# EAGLE design Wykonana (EAGLE 6.1)
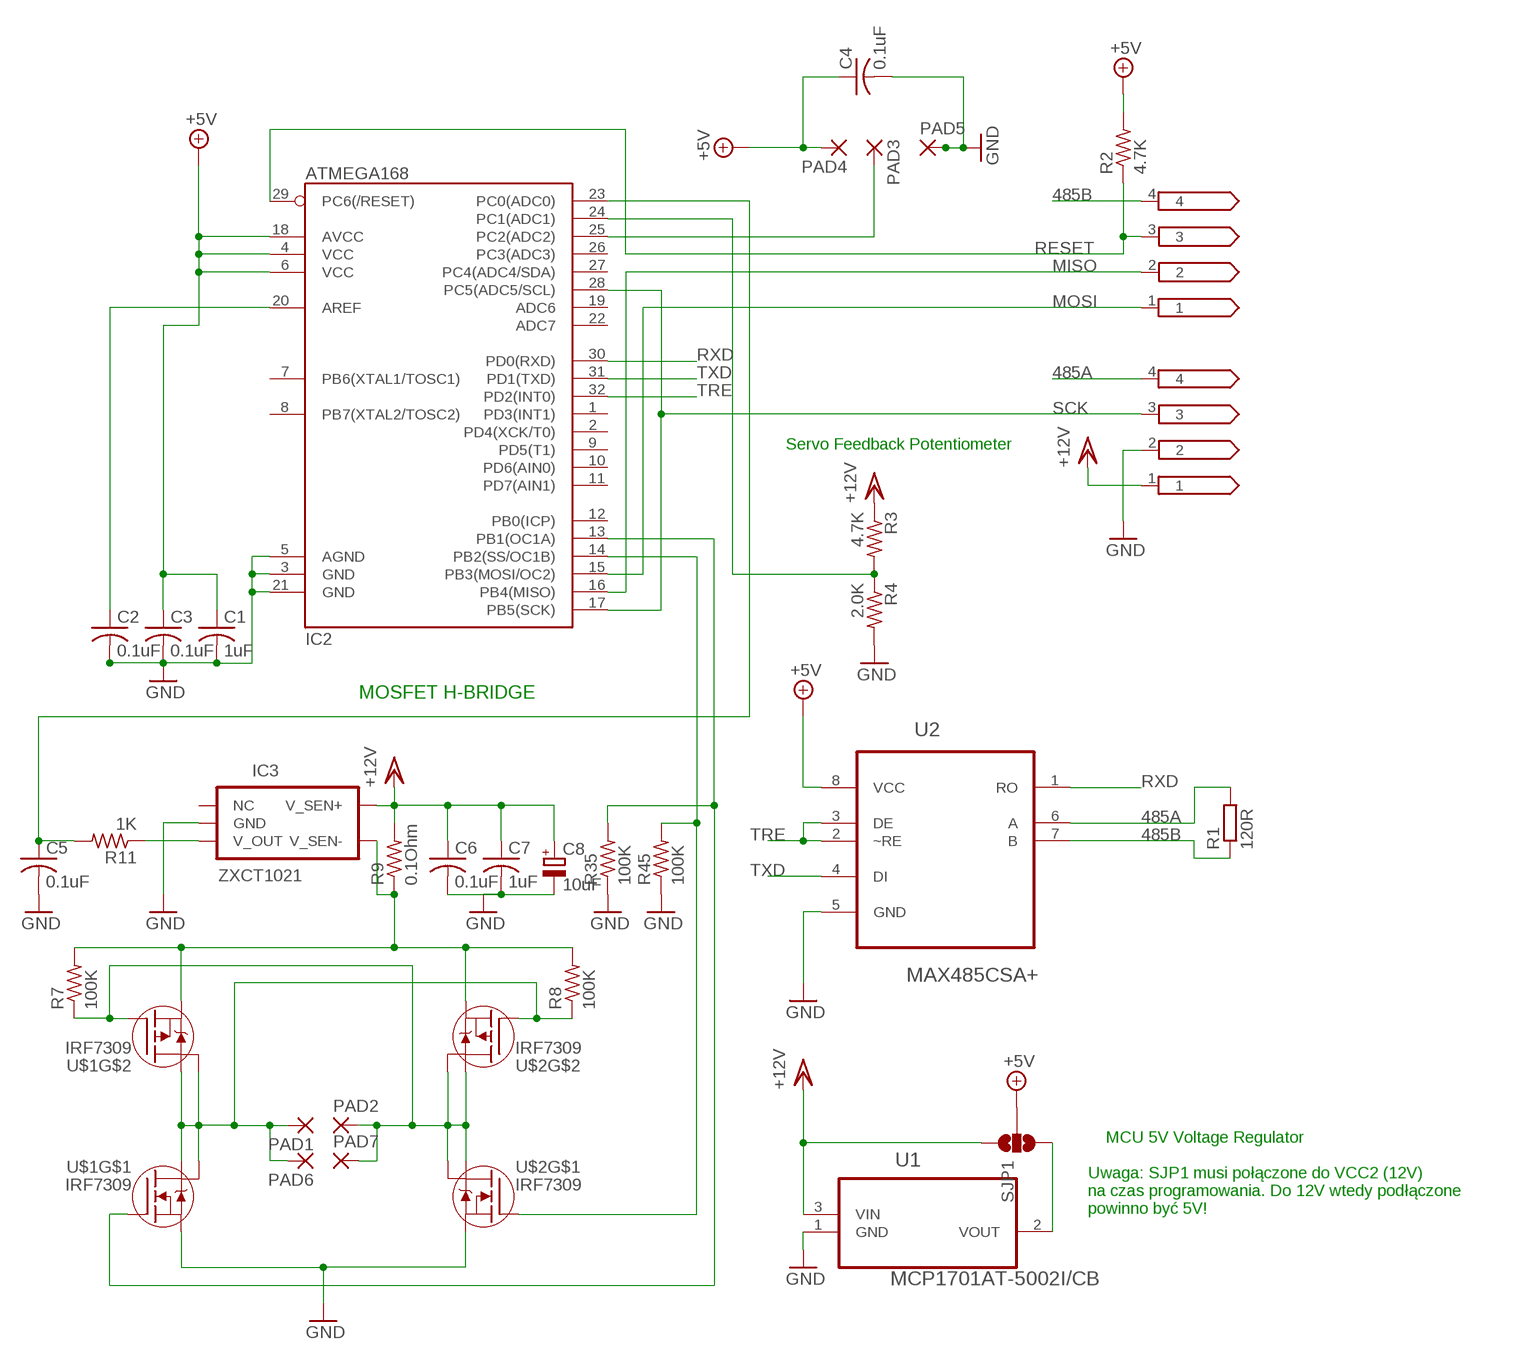
[diagram p0: schematic, sheet 1]

## Parts
C1  1uF  C-USC0603  [C0603]
C2  0.1uF  C-USC0603  [C0603]
C3  0.1uF  C-USC0603  [C0603]
C4  0.1uF  C-USC0603  [C0603]
C5  0.1uF  C-USC0603K  [C0603K]
C6  0.1uF  C-USC0603  [C0603]
C7  1uF  C-USC0603  [C0603]
C8  10uF  CPOL-EUA/3216-18R  [A/3216-18R]
IC2  ATMEGA168  [TQFP32-08]
IC3  ZXCT1021  ZXCT1021SOT23-5  [SOT23-5]
JP1  4-EDGEVERSION2  [4-PIN-EDGE-V2]
JP2  4-EDGEVERSION2  [4-PIN-EDGE-V2]
PAD1  2,15/1,0  [2,15/1,0]
PAD2  2,15/1,0  [2,15/1,0]
PAD3  1,6/0,8  [1,6/0,8]
PAD4  1,6/0,8  [1,6/0,8]
PAD5  1,6/0,8  [1,6/0,8]
PAD6  2,15/1,0  [2,15/1,0]
PAD7  2,15/1,0  [2,15/1,0]
R1  120R  R-EU_R0603  [R0603]
R2  4.7K  R-US_R0603  [R0603]
R3  4.7K  R-US_R0603  [R0603]
R4  2.0K  R-US_R0603  [R0603]
R7  100K  R-US_R0603  [R0603]
R8  100K  R-US_R0603  [R0603]
R9  0.1Ohm  R-US_R0603  [R0603]
R11  1K  R-US_R0603  [R0603]
R35  100K  R-US_R0603  [R0603]
R45  100K  R-US_R0603  [R0603]
SJP1  SOLDERJUMPER_2WAYPASTE2&3  [SJ_3_PASTE2&3]
U1  MCP1701AT-5002I/CB  [SOT95P255X145-3N]
U2  MAX485CSA+  [SOIC127P600X175-8N]
U$1  IRF7309  [SO8-2]
U$2  IRF7309  [SO8-2]

## Nets
485A: JP1.4 R1.2 U2.6(A)
485B: JP2.4 R1.1 U2.7(B)
+5V: C1.1 C3.1 C4.1 IC2.4(VCC) IC2.6(VCC) IC2.18(AVCC) PAD4.1(P) R2.2 SJP1.2 U2.8(VCC)
CURRENT: C5.1 IC2.23(PC0(ADC0)) R11.2
GND: C1.2 C2.2 C3.2 C4.2 C5.2 C6.2 C7.2 C8.- IC2.3(GND) IC2.5(AGND) IC2.21(GND) IC3.2(GND) JP1.2 PAD5.1(P) R4.2 R35.1 R45.1 U1.1(GND) U2.5(GND) U$1.1(S) U$2.1(S)
MISO: IC2.16(PB4(MISO)) JP2.2
MOSI: IC2.15(PB3(MOSI/OC2)) JP2.1
N$1: SJP1.3 U1.2(VOUT)
N$4: PAD2.1(P) PAD7.1(P) R7.1 U$1.4(G) U$2.5(D) U$2.6(D) U$2.7(D) U$2.8(D)
N$5: IC3.3(V_OUT) R11.1
N$10: IC3.5(V_SEN-) R7.2 R8.2 R9.1 U$1.3(S) U$2.3(S)
N$11: IC2.14(PB2(SS/OC1B)) R45.2 U$2.2(G)
N$14: IC2.25(PC2(ADC2)) PAD3.1(P)
N$19: IC2.13(PB1(OC1A)) R35.2 U$1.2(G)
N$21: C2.1 IC2.20(AREF)
N$22: IC2.24(PC1(ADC1)) R3.2 R4.1
N$23: PAD1.1(P) PAD6.1(P) R8.1 U$1.5(D) U$1.6(D) U$1.7(D) U$1.8(D) U$2.4(G)
RESET: IC2.29(PC6(/RESET)) JP2.3 R2.1
RXD: IC2.30(PD0(RXD)) U2.1(RO)
SCK: IC2.17(PB5(SCK)) IC2.28(PC5(ADC5/SCL)) JP1.3
TRE: IC2.32(PD2(INT0)) U2.2(~RE) U2.3(DE)
TXD: IC2.31(PD1(TXD)) U2.4(DI)
VCC/2: C6.1 C7.1 C8.+ IC3.4(V_SEN+) JP1.1 R3.1 R9.2 SJP1.1 U1.3(VIN) ; supply symbol labelled +12V
Unconnected: IC2.1(PD3(INT1)) IC2.2(PD4(XCK/T0)) IC2.7(PB6(XTAL1/TOSC1)) IC2.8(PB7(XTAL2/TOSC2)) IC2.9(PD5(T1)) IC2.10(PD6(AIN0)) IC2.11(PD7(AIN1)) IC2.12(PB0(ICP)) IC2.19(ADC6) IC2.22(ADC7) IC2.26(PC3(ADC3)) IC2.27(PC4(ADC4/SDA)) IC3.1(NC)

## Notes on the sheet
- Servo Feedback Potentiometer
- MOSFET H-BRIDGE
- MCU 5V Voltage Regulator
- Uwaga: SJP1 musi połączone do VCC2 (12V)
- na czas programowania. Do 12V wtedy podłączone
- powinno być 5V!

## Library data of the parts
C1-C7 = rcl:C-US: CAPACITOR, American symbol
C8 = rcl:CPOL-EU: POLARIZED CAPACITOR, European symbol
IC2 = MOJA:ATMEGA168
IC3 = MOJA:ZXCT1021: Low offset high-side current monitor http://www.diodes.com/zetex/_pdfs/3.0/pdf/ZXCT1021.pdf
JP1 JP2 = openservo:4-EDGE
PAD1 PAD2 PAD6 PAD7 = wirepad:2,15/1,0: THROUGH-HOLE PAD
PAD3-PAD5 = wirepad:1,6/0,8: THROUGH-HOLE PAD
R1 = resistor:R-EU_: RESISTOR, European symbol
R2-R4 R7-R9 R11 R35 R45 = rcl:R-US_: RESISTOR, American symbol
SJP1 = MOJA:SOLDERJUMPER_2WAY: Solder Jumper 2 way solder jumper
U1 = mcp1701AT-5002:MCP1701AT-5002I/CB: IC, LDO REG, 250MA, 5.0V; MPN: MCP1701AT-5002I/CB; OC_FARNELL: 1605556; OC_NEWARK: 11N7987; PACKAGE: SOT-23; SUPPLIER: MICROCHIP
U2 = MAX485CSA:MAX485CSA+: ±15kV ESD-Protected, Slew-Rate-Limited, Low-Power, RS-485/RS-422 Transceivers; MPN: MAX485CSA+; OC_FARNELL: 9725954; OC_NEWARK: 68K4795; PACKAGE: SOIC-8; SUPPLIER: Maxim
U$1 U$2 = irf-2:IRF7309

## Board
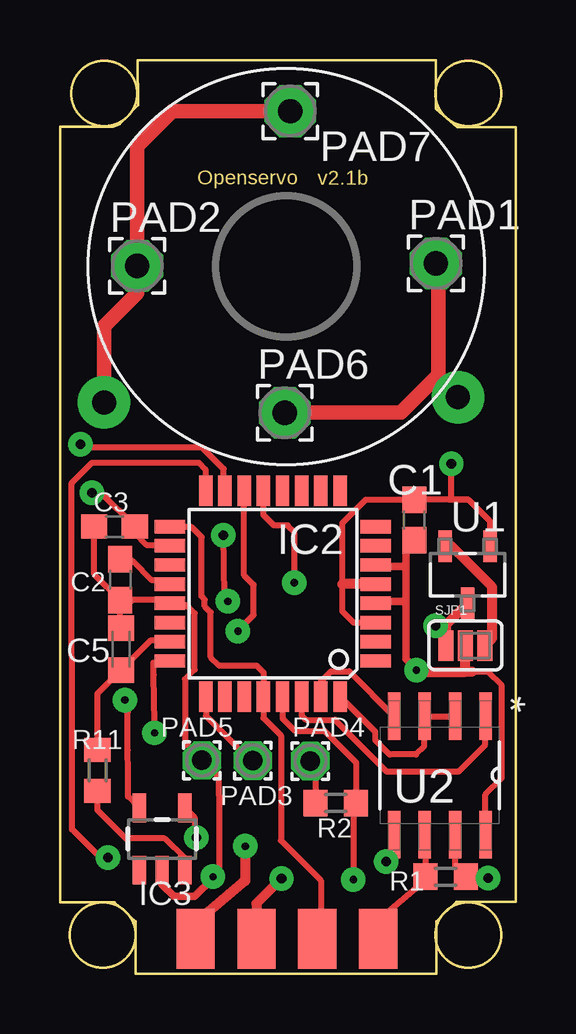
[diagram p1: board, top side]
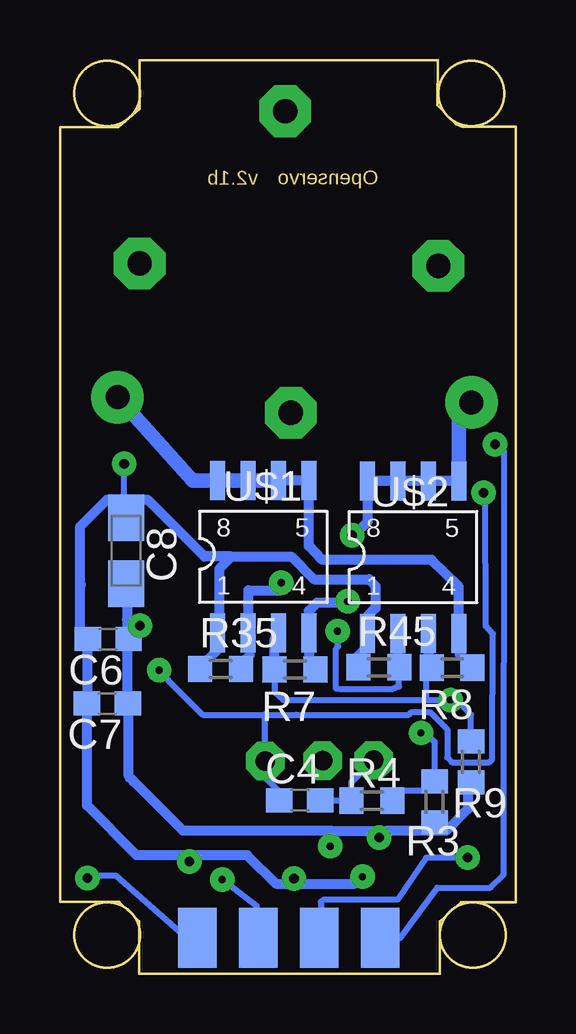
[diagram p2: board, bottom side, seen from below]

Size 19 x 38.09 mm. Coordinates in mm from the lower left corner, seen from the top.
Outline: 3.15,0 15.7,0 15.7,2.18 16.53,3 19,2.99 19,35.28 16.57,35.3 15.67,36.06 15.67,38.08 3.56,38.09 3.24,38.09 3.26,36.2 2.49,35.41 2.21,35.31 1.66,35.3 0,35.32 0,2.97 2.28,2.97 3.15,2.18 3.15,0
Outline: circle at 1.78,1.62 radius 1.36
Outline: circle at 17.04,1.62 radius 1.36
Outline: circle at 17.04,36.69 radius 1.36
Outline: circle at 1.85,36.69 radius 1.36
Copper layers (1*16): Top 0.035mm / dielectric 1.5mm / Bottom 0.035mm
Design rules: minimum track width 5mil, minimum drill 10mil, track to track 8mil, track to pad 8mil, pad to pad 8mil, via to via 4mil, smd to smd 2mil, copper to edge 4mil, drill to drill 4mil, minimum pad ring 10mil, minimum via ring 8mil, stop-mask expansion 2mil, vias tented up to drill 0mil, thermal gap 10mil

### Footprints (pad centres in the part's own frame; a part is rotated, then mirrored left to right if it is on the bottom)
C0603 = smd 1.1 x 1: 1 -0.85,0; 2 0.85,0
C0603K = smd 1.05 x 1.08: 1 -0.875,0; 2 0.875,0
A/3216-18R = smd 1.95 x 1.5: + 1.375,0; - -1.375,0
TQFP32-08 = smd 1.27 x 0.559: 1 -4.293,2.8; 2 -4.293,2; 3 -4.293,1.2; 4 -4.293,0.4; 5 -4.293,-0.4; 6 -4.293,-1.2; 7 -4.293,-2; 8 -4.293,-2.8; 17 4.293,-2.8; 18 4.293,-2; 19 4.293,-1.2; 20 4.293,-0.4; 21 4.293,0.4; 22 4.293,1.2; 23 4.293,2; 24 4.293,2.8 | smd 0.559 x 1.27: 9 -2.8,-4.293; 10 -2,-4.293; 11 -1.2,-4.293; 12 -0.4,-4.293; 13 0.4,-4.293; 14 1.2,-4.293; 15 2,-4.293; 16 2.8,-4.293; 25 2.8,4.293; 26 2,4.293; 27 1.2,4.293; 28 0.4,4.293; 29 -0.4,4.293; 30 -1.2,4.293; 31 -2,4.293; 32 -2.8,4.293
SOT23-5 = smd 0.55 x 1.2: 1 -0.95,-1.3; 2 0,-1.3; 3 0.95,-1.3; 4 0.95,1.3; 5 -0.95,1.3
4-PIN-EDGE-V2 = smd 2.5 x 1.6: 1 0.508,4.318; 2 0.508,1.778; 3 0.508,-0.762; 4 0.508,-3.302
2,15/1,0 = drill 1.016 pad 2.159 octagon: 1 0,0
1,6/0,8 = drill 0.813 pad 1.6 octagon: 1 0,0
R0603 = smd 1 x 1.1: 1 -0.85,0; 2 0.85,0
SJ_3_PASTE2&3 = smd 0.635 x 1.27: 1 -0.813,0; 2 0,0; 3 0.813,0
SOT95P255X145-3N = smd 0.559 x 1.321: 1 -0.94,-1.194; 2 0.94,-1.194; 3 0,1.194
SOIC127P600X175-8N = smd 1.981 x 0.533: 1 -2.464,1.905; 2 -2.464,0.635; 3 -2.464,-0.635; 4 -2.464,-1.905; 5 2.464,-1.905; 6 2.464,-0.635; 7 2.464,0.635; 8 2.464,1.905
SO8-2 = smd 0.61 x 1.626: 1 -2.54,-2.54; 2 -1.27,-2.54; 3 0,-2.54; 4 1.27,-2.54; 5 1.27,3.81; 6 0,3.81; 7 -1.27,3.81; 8 -2.54,3.81

### Placement (x,y rotation side)
C1  14.77,18.91 90 top
C2  2.51,16.42 270 top
C3  2.28,18.63 180 top
C4  9,7.23 0 bottom
C5  2.55,13.53 90 top
C6  16.98,13.95 180 bottom
C7  17.02,11.27 180 bottom
C8  16.24,17.63 270 bottom
IC2  8.88,15.84 180 top
IC3  4.26,5.62 0 top
JP1  9.97,0.94 90 top
JP2  9.96,2 270 bottom
PAD1  15.68,29.61 0 top
PAD2  3.22,29.51 0 top
PAD3  8.04,8.88 0 top
PAD4  10.44,8.87 0 top
PAD5  5.92,8.89 0 top
PAD6  9.38,23.38 0 top
PAD7  9.61,35.96 0 top
R1  16.08,4.04 180 top
R2  11.5,7.12 180 top
R3  3.38,7.17 90 bottom
R4  5.99,7.22 180 bottom
R7  9.2,12.69 180 bottom
R8  2.65,12.76 180 bottom
R9  1.86,8.83 270 bottom
R11  1.57,8.48 90 top
R35  12.3,12.71 0 bottom
R45  5.7,12.77 0 bottom
SJP1  16.91,13.68 0 top
U1  17,16.63 180 top
U2  15.84,8.27 270 top
U$1  9.89,16.74 0 bottom
U$2  3.64,16.73 0 bottom

### Tracks (layer width: path | path; a pad name or v marks a point on that pad's centre or on a via)
485A
  Top 0.254: JP1.4 13.25,1.48 13.25,2.23 15.4,4.04 R1.2 15.23,5.78 U2.6
485B  (via drill 0.4 pad 1.02)
  Top 0.254: v17.85,3.99 18.14,4.04 R1.1 | 17.5,4.07 R1.1 | U2.7 16.48,4.5 R1.1
  Bottom 0.254: JP2.4 13.26,1.6 13.85,1.6 16.65,4.08 18.13,4.08 v17.85,3.99
+5V  (via drill 0.3 pad 1.02, 0.4 pad 1.02)
  Top 0.254: IC2.18 4.51,17.73 4.36,17.96 4.27,17.87 3.6,17.87 3.13,18.34 C3.1 1.72,20.04 v1.33,20.04 | 13.18,15.5 13.11,15.5 | 13.18,15.5 IC2.4 | 13.26,17.07 13.34,16.98 | 13.18,15.5 13.19,15.51 | R2.2 10.67,7.99 10.67,8.64 PAD4.1 | U2.8 17.75,7.47 18.42,8.14 18.42,12.03 17.86,12.59 17.19,12.59
  Top 0.305: v14.86,12.65 14.86,12.69 14.43,13.12 14.43,15.45 | 14.43,15.45 14.43,16.98 | 14.43,16.98 14.43,17.61 C1.1 | 13.34,16.98 14.43,16.98 | 13.19,15.51 14.37,15.51 14.43,15.45
  Top 0.406: 13.26,17.07 IC2.6 | 16.91,12.59 SJP1.2 | v14.86,12.65 15.23,12.59 16.91,12.59 | 17.19,12.59 16.91,12.59 | C1.1 14.71,17.89
  Bottom 0.254: v1.33,20.04 1.26,19.7 1.25,14.49 0.95,14.16 0.97,9.11 0.97,8.93 1.08,8.82 2.66,8.82 2.85,9.01 2.85,10.19 3.57,10.91 4.33,10.91 4.45,10.8 9.15,10.8 | v14.86,12.65 14.48,12.23 13.05,10.8 9.15,10.8 | C4.1 9.67,7.41 10.43,8.17 PAD4.1 10.44,9.26 10.44,10.81 9.15,10.8
CURRENT
  Top 0.254: 4.72,13.82 4.54,13.79 IC2.23 4.49,13.84 4.42,13.91 4.4,13.88 3.78,13.88 C5.1 | 2.8,13.01 C5.1 | R11.2 1.57,11.68 C5.1
GND  (via drill 0.3 pad 1.02, 0.4 pad 1.02)
  Top 0.254: IC2.21 4.56,15.39 4.54,15.41 4.51,15.36 | IC2.21 4.76,15.38 4.84,15.48 4.83,15.36 5.28,15.36 5.62,15.03 5.62,12.68 5.21,12.27 5.22,9.63 5.5,9.32 PAD5.1 6.63,8.17 6.63,7.44 6.63,4.3 v6.38,4.04 | IC2.3 12.24,14.64 11.77,15.12 11.77,16.25 11.77,18.77 12.76,19.76 C1.2 17.04,19.76 | IC2.21 4.3,15.44 4.33,15.46 4.22,15.57 C2.2 | 8.08,1.56 JP1.2 | C2.2 3.03,15.57 | C2.2 1.43,16.65 C3.2 | C5.2 2.51,14.45 C2.2 | 17.04,19.76 17.94,18.86 U1.1 | 17.04,19.76 17.02,19.75 16.21,19.75 16.32,19.87 v16.32,21.25
  Top 0.305: 8.08,1.56 8.23,1.72 | v6.38,4.04 6.38,3.98 5.62,3.22 4.75,3.22 4.26,3.71 IC3.2
  Top 0.406: IC2.5 11.77,16.24 11.77,16.25 | U2.5 13.94,5.01 v13.61,4.68 | v9.24,3.97 8.2,2.92 JP1.2
  Bottom 0.254: R45.1 6.6,12.75 | U$1.1 12.36,13.59 12.46,13.69 | 13.15,12.78 R35.1 | U$1.1 12.43,13.5 | 6.18,14.9 U$2.1 6.18,14.25 6.19,14.26 6.19,13.63 | U$1.1 12.43,14.29 12.45,14.32 12.36,14.4 | C4.2 6.85,7.23 R4.2 6.84,7.24 6.85,7.98 PAD5.1 | v13.61,4.68 13.61,4.8 13.75,4.94 | 16.19,19.76 16.32,19.89 v16.32,21.25
  Bottom 0.406: 12.43,13.5 13.15,12.78 | 6.18,14.9 5.83,15.24 5.83,16.16 6.11,16.44 8.4,16.44 9.35,17.39 11.84,17.39 | 11.84,17.39 12.36,16.87 12.36,14.4 | R45.1 6.56,13.26 6.19,13.63 | R35.1 13.24,12.61 | 9.45,3.75 6.71,3.75 v6.38,4.04 | 9.45,3.75 10,3.75 11.19,4.94 13.75,4.94 15.8,4.94 17.87,7.01 C7.2 17.84,11.31 C6.2 18.15,13.95 18.15,16.22 | 9.45,3.75 v9.24,3.97 | 18.15,16.22 18.13,16.22 | 11.84,17.39 12.97,17.39 15.35,19.76 16.19,19.76 16.21,19.75 | 18.15,16.22 18.15,18.65 17.05,19.75 16.21,19.75 | C8.- 16.21,19.01 16.21,19.75
MISO  (via drill 0.4 pad 1.02)
  Top 0.254: IC2.16 6.07,20.6 6.07,21.03 5.8,21.3 1.34,21.3 0.49,20.45 0.5,6.01 1.67,4.84 v2,4.84
  Bottom 0.254: JP2.2 8.12,1.68 8.12,2.99 8.01,3.09 4.92,3.09 3.73,4.84 v2,4.84
MOSI  (via drill 0.4 pad 1.02)
  Top 0.254: IC2.15 6.88,20.25 6.83,20.31 6.83,21.05 5.94,21.94 0.73,21.94 v0.86,22.08
  Bottom 0.254: 5.67,2.16 JP2.1 4.8,1.49 3.27,3.58 1.05,3.58 0.5,4.13 0.47,21.77 0.68,21.97 v0.86,22.08
N$1
  Top 0.406: SJP1.3 18.03,13.99 18.03,16.12 16.32,17.82 U1.2
N$4  (via drill 0.3 pad 1.02, 0.4 pad 1.02, 1 pad 2.18)
  Top 0.254: v7,15.52 7,15.56 6.84,15.73 v6.81,18.28
  Top 0.61: PAD7.1 9.61,35.88 9.59,35.87 9.5,35.96 4.68,35.96 3.22,34.5 PAD2.1 3.22,28.38 1.83,26.99 v1.83,23.82
  Bottom 0.254: U$2.5 2.37,20.59 2.32,20.64 | 8.62,13.02 R7.1
  Bottom 0.406: U$2.5 U$2.6 U$2.7 U$2.8 6.18,18.84 6.91,18.1 v6.81,18.28 | 8.62,13.02 U$1.4 8.62,15.13 8.29,15.46 7.1,15.46 7.09,15.45 v7,15.52
  Bottom 0.61: 2.42,20.54 U$2.5 2.37,23.28 v1.83,23.82
N$5
  Top 0.254: R11.1 1.57,6.82 2.75,5.64 4.37,5.64 5.21,4.8 IC3.3 5.21,4.69
N$10  (via drill 0.3 pad 1.02)
  Top 0.254: IC3.5 2.84,7.39 2.84,8.41 2.82,9.32 2.82,10.9 2.71,11.01 v2.71,11.41
  Bottom 0.254: 3.61,13.12 3.42,12.93 R8.2 3.42,12.56 3.74,12.25 3.74,11.42 3.75,11.41 | U$1.3 9.88,14.1 10.05,13.94 | 10.03,12.49 10.03,11.72 9.66,11.39 3.76,11.39 3.75,11.41 | R9.1 1.86,10.8 2.47,11.41 v2.71,11.41 3.75,11.41
  Bottom 0.406: 3.61,13.12 U$2.3 | 10.05,13.94 R7.2 10.05,12.51 10.03,12.49
N$11  (via drill 0.3 pad 1.02)
  Top 0.254: IC2.14 7.68,16.61 8.08,16.21 8.08,14.96 7.42,14.3 v7.42,14.28
  Bottom 0.254: v7.42,14.28 7.4,14.06 7.4,13.64 7.49,13.55 7.49,11.88 7.31,11.85 5.15,11.85 4.86,11.97 4.86,12.42 4.86,12.43 R45.2 4.86,12.69 4.91,12.74
  Bottom 0.406: 4.91,12.74 U$2.2
N$14
  Top 0.254: 6.08,11.21 IC2.25 6.09,10.75 7.38,9.45 7.66,9.16 PAD3.1
N$19  (via drill 0.3 pad 1.02)
  Top 0.254: IC2.13 8.48,19.12 8.92,18.68 9.49,18.68 9.77,18.41 9.77,16.41 9.8,16.39 9.77,16.36 v9.77,16.3
  Bottom 0.254: 9.77,15.98 v9.77,16.3 | 11.08,14.61 11.08,14.67 | 11.08,14.61 11.08,13.29 | 11.45,12.92 R35.2 | 11.08,14.61 11.09,14.61 11.15,14.54 U$1.2
  Bottom 0.406: 11.08,14.67 11.14,14.73 11.14,15.98 9.77,15.98 | 11.08,13.29 11.45,12.92
N$21
  Top 0.254: IC2.20 4.62,16.19 4.54,16.2 4.47,16.31 4.35,16.18 4.13,16.4 3.83,16.4 3.03,17.2 C2.1
N$22  (via drill 0.3 pad 1.02)
  Top 0.254: IC2.24 3.9,12.96 3.92,12.46 3.94,10.44 v3.94,10.04
  Bottom 0.254: 3.75,10.12 v3.94,10.04 3.75,10.04 3.38,9.67 R3.2 3.5,8.02 3.88,7.64 4.72,7.64 R4.1
N$23  (via drill 1 pad 2.18)
  Top 0.254: 15.67,29.52 15.7,29.52 15.68,29.54 PAD1.1
  Top 0.61: 15.67,29.52 PAD1.1 | PAD6.1 14.23,23.38 15.79,24.95 | 15.79,24.95 15.79,29.5 PAD1.1 | 15.79,24.95 15.79,24.84 v16.6,24.03
  Bottom 0.254: U$2.4 2.34,13.32 | 1.72,12.71 R8.1 | U$1.6 9.84,20.55 9.84,20.56 | U$1.7 11.18,20.55 | 12.4,20.55 U$1.8
  Bottom 0.406: 2.34,13.32 1.72,12.71 | 9.84,20.55 U$1.5 8.62,17.82 8.07,17.25 3.51,17.25 2.37,16.13 U$2.4 | U$1.6 U$1.7 12.4,20.55
  Bottom 0.61: 9.84,20.56 13.47,20.56 v16.6,24.03
RESET  (via drill 0.3 pad 1.02)
  Top 0.254: IC2.29 9.28,10.64 9.8,10.12 11.03,10.12 12.35,8.8 R2.1 12.23,7 v12.23,3.93
  Bottom 0.254: JP2.3 10.79,1.55 10.79,2.81 v12.23,3.93
RXD
  Top 0.254: IC2.30 10.08,10.77 10.27,10.58 11.47,10.58 13.63,8.42 16.62,8.42 17.73,9.54 17.73,10.72 U2.1
SCK
  Top 0.254: 8.5,11.39 8.47,11.36 8.47,11.38 | 8.5,11.39 8.5,12.54 8.21,12.83 6.65,12.83 6.29,13.19 6.29,15.06 6.04,15.32 6.04,15.6 5.9,15.74 5.9,18.18 5.91,18.19 5.91,18.2 5.49,18.62 4.69,18.62 4.67,18.64 IC2.17 | 8.47,11.38 8.46,11.38 | 8.47,11.38 8.48,11.36 8.48,11.34 8.45,11.31 8.49,11.27 8.49,10.66 9.21,9.93 9.21,5.55 10.88,3.89 10.88,1.59 JP1.3 | 8.5,11.39 8.48,11.41 IC2.28
TRE
  Top 0.254: IC2.32 11.73,11.55 11.74,11.56 | U2.2 U2.3 15.19,10.72 15.19,9.48 14.85,9.13 13.77,9.13 13.76,9.12 13.14,9.74 13.14,10.1 IC2.32 | 11.68,11.44 IC2.32
TXD
  Top 0.254: IC2.31 10.88,12.18 11.31,12.6 12.07,12.6 U2.4
VCC/2  (via drill 0.3 pad 1.02, 0.4 pad 1.02)
  Top 0.254: IC3.4 5.61,6.52 5.61,5.76 v5.69,5.67
  Top 0.406: v7.73,5.31 7.73,3.86 5.63,2.1 5.63,1.48 JP1.1 | 16.1,13.91 v15.66,14.51 | U1.3 16.1,14.53 16.1,13.91 | 16.1,13.91 SJP1.1
  Bottom 0.254: 1.68,8.32 1.72,8.28 1.68,8.24 1.72,8.24 1.98,7.98 R9.2
  Bottom 0.406: 1.98,7.98 1.98,6.86 2.89,5.96 3.37,5.96 | 3.37,5.96 5.35,5.96 | 5.35,5.96 v5.69,5.67 | R3.1 3.38,5.97 3.37,5.96 | 7.69,5.96 5.35,5.96 | v7.73,5.31 7.73,5.92 7.69,5.96 | 7.69,5.96 13.87,5.96 15.93,8.02 15.93,8.03 16.13,8.23 16.13,11.23 C7.1 16.17,13.91 | 16.17,13.91 C6.1 | 16.17,13.91 16.17,14.72 | v15.66,14.51 16.1,14.65 16.17,14.72 | 16.17,14.72 16.21,14.76 16.21,15.6 16.21,16.15 16.21,16.26 C8.+

### Text on the board
Dimension: Openservo | v2.1b